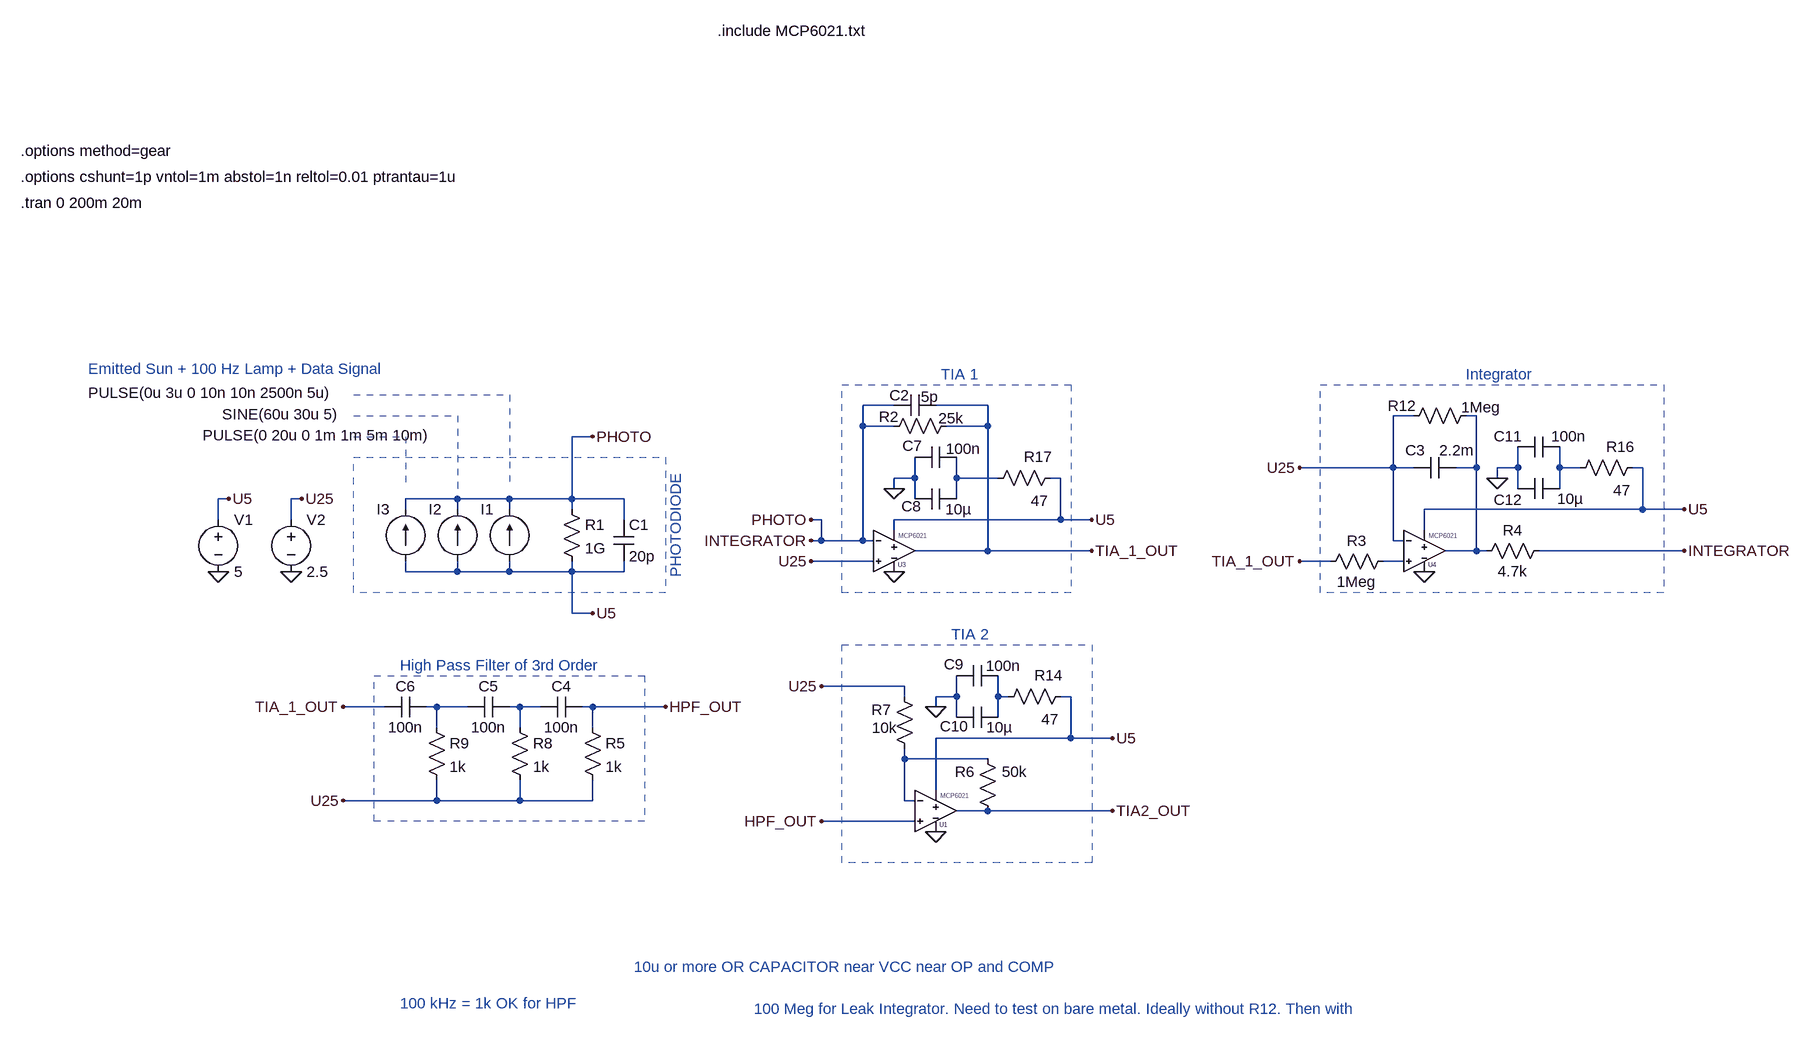
[diagram p0: schematic Odbiornik_WO_TLV3501_REAL_LAMPS.asc]
Odbiornik_WO_TLV3501_REAL_LAMPS.asc, the LTspice schematic file:
Version 4.1
SHEET 1 2432 1780
WIRE 704 336 656 336
WIRE 848 336 768 336
WIRE 1504 352 1472 352
WIRE 1600 352 1584 352
WIRE 656 368 656 336
WIRE 704 368 656 368
WIRE 848 368 848 336
WIRE 848 368 784 368
WIRE 240 384 208 384
WIRE 1472 432 1472 352
WIRE 1472 432 1328 432
WIRE 1504 432 1472 432
WIRE 1600 432 1600 352
WIRE 1600 432 1568 432
WIRE 1664 432 1664 400
WIRE 1664 432 1632 432
WIRE 1728 432 1728 400
WIRE 1760 432 1728 432
WIRE 1856 432 1840 432
WIRE 736 448 736 416
WIRE 736 448 704 448
WIRE 800 448 800 416
WIRE 864 448 800 448
WIRE 960 448 944 448
WIRE 1632 448 1632 432
WIRE 704 464 704 448
WIRE 1664 464 1664 432
WIRE 1728 464 1728 432
WIRE -320 480 -336 480
WIRE -208 480 -224 480
WIRE 32 480 -48 480
WIRE 112 480 32 480
WIRE 208 480 208 384
WIRE 208 480 112 480
WIRE 288 480 208 480
WIRE 736 480 736 448
WIRE 800 480 800 448
WIRE -48 496 -48 480
WIRE 32 496 32 480
WIRE 112 496 112 480
WIRE 208 496 208 480
WIRE 1856 496 1856 432
WIRE 1856 496 1520 496
WIRE 1920 496 1856 496
WIRE -336 512 -336 480
WIRE -224 512 -224 480
WIRE 288 512 288 480
WIRE 592 512 576 512
WIRE 960 512 960 448
WIRE 960 512 704 512
WIRE 1008 512 960 512
WIRE 704 528 704 512
WIRE 1520 528 1520 496
WIRE 592 544 592 512
WIRE 592 544 576 544
WIRE 656 544 656 368
WIRE 656 544 592 544
WIRE 672 544 656 544
WIRE 1472 544 1472 432
WIRE 1488 544 1472 544
WIRE 848 560 848 368
WIRE 848 560 736 560
WIRE 1008 560 848 560
WIRE 1600 560 1600 432
WIRE 1600 560 1552 560
WIRE 1616 560 1600 560
WIRE 1920 560 1696 560
WIRE 672 576 576 576
WIRE 1376 576 1328 576
WIRE 1488 576 1456 576
WIRE -48 592 -48 576
WIRE 32 592 32 576
WIRE 32 592 -48 592
WIRE 112 592 112 576
WIRE 112 592 32 592
WIRE 208 592 208 576
WIRE 208 592 112 592
WIRE 288 592 288 576
WIRE 288 592 208 592
WIRE 208 656 208 592
WIRE 240 656 208 656
WIRE 720 768 592 768
WIRE 720 784 720 768
WIRE 800 784 800 752
WIRE 800 784 768 784
WIRE 864 784 864 752
WIRE 880 784 864 784
WIRE 976 784 960 784
WIRE -80 800 -144 800
WIRE 0 800 -16 800
WIRE 48 800 0 800
WIRE 128 800 112 800
WIRE 160 800 128 800
WIRE 240 800 224 800
WIRE 352 800 240 800
WIRE 768 800 768 784
WIRE 800 816 800 784
WIRE 864 816 864 784
WIRE 0 832 0 800
WIRE 128 832 128 800
WIRE 240 832 240 800
WIRE 976 848 976 784
WIRE 976 848 768 848
WIRE 1040 848 976 848
WIRE 720 880 720 864
WIRE 848 880 720 880
WIRE 768 928 768 848
WIRE 0 944 0 912
WIRE 0 944 -144 944
WIRE 128 944 128 912
WIRE 128 944 0 944
WIRE 240 944 240 912
WIRE 240 944 128 944
WIRE 720 944 720 880
WIRE 736 944 720 944
WIRE 848 960 800 960
WIRE 1040 960 848 960
WIRE 736 976 592 976
FLAG -336 592 0
FLAG -224 592 0
FLAG 1008 560 TIA_1_OUT
FLAG 1040 960 TIA2_OUT
FLAG 240 384 PHOTO
FLAG 240 656 U5
FLAG 1920 496 U5
FLAG 704 592 0
FLAG 1008 512 U5
FLAG 1328 432 U25
FLAG 576 576 U25
FLAG 576 544 INTEGRATOR
FLAG 1920 560 INTEGRATOR
FLAG 1520 592 0
FLAG 1328 576 TIA_1_OUT
FLAG -144 944 U25
FLAG -144 800 TIA_1_OUT
FLAG 352 800 HPF_OUT
FLAG 592 976 HPF_OUT
FLAG 592 768 U25
FLAG 1040 848 U5
FLAG 768 992 0
FLAG -320 480 U5
FLAG -208 480 U25
FLAG 576 512 PHOTO
FLAG 1632 448 0
FLAG 704 464 0
FLAG 768 800 0
SYMBOL res 192 480 R0
SYMATTR InstName R1
SYMATTR Value 1G
SYMBOL cap 272 512 R0
SYMATTR InstName C1
SYMATTR Value 20p
SYMBOL current 112 576 R180
WINDOW 0 24 80 Left 2
WINDOW 3 648 259 Right 2
WINDOW 123 0 0 Left 0
WINDOW 39 0 0 Left 0
SYMATTR InstName I1
SYMATTR Value PULSE(0u 3u 0 10n 10n 2500n 5u)
SYMBOL voltage -336 496 R0
WINDOW 123 0 0 Left 0
WINDOW 39 0 0 Left 0
SYMATTR InstName V1
SYMATTR Value 5
SYMBOL voltage -224 496 R0
WINDOW 123 0 0 Left 0
WINDOW 39 0 0 Left 0
SYMATTR InstName V2
SYMATTR Value 2.5
SYMBOL res 800 352 R90
WINDOW 0 17 104 VBottom 2
WINDOW 3 -12 8 VTop 2
SYMATTR InstName R2
SYMATTR Value 25k
SYMBOL cap 768 320 R90
WINDOW 0 16 56 VBottom 2
WINDOW 3 -13 9 VTop 2
SYMATTR InstName C2
SYMATTR Value 5p
SYMBOL res 1360 592 R270
WINDOW 0 32 56 VTop 2
WINDOW 3 0 56 VBottom 2
SYMATTR InstName R3
SYMATTR Value 1Meg
SYMBOL cap 1504 448 R270
WINDOW 0 27 2 VTop 2
WINDOW 3 27 66 VTop 2
SYMATTR InstName C3
SYMATTR Value 2.2m
SYMBOL res 1600 576 R270
WINDOW 0 32 56 VTop 2
WINDOW 3 0 56 VBottom 2
SYMATTR InstName R4
SYMATTR Value 4.7k
SYMBOL current 32 576 R180
WINDOW 0 24 80 Left 2
WINDOW 3 362 226 Right 2
WINDOW 123 0 0 Left 0
WINDOW 39 0 0 Left 0
SYMATTR InstName I2
SYMATTR Value SINE(60u 30u 5)
SYMBOL cap 224 784 R90
WINDOW 0 0 32 VBottom 2
WINDOW 3 32 32 VTop 2
SYMATTR InstName C4
SYMATTR Value 100n
SYMBOL res 224 816 R0
SYMATTR InstName R5
SYMATTR Value 1k
SYMBOL res 864 976 R180
WINDOW 0 36 76 Left 2
WINDOW 3 -45 76 Left 2
SYMATTR InstName R6
SYMATTR Value 50k
SYMBOL res 736 880 R180
WINDOW 0 36 76 Left 2
WINDOW 3 27 48 Left 2
SYMATTR InstName R7
SYMATTR Value 10k
SYMBOL MCP6021 768 960 R0
SYMATTR InstName U1
SYMBOL MCP6021 704 560 R0
SYMATTR InstName U3
SYMBOL MCP6021 1520 560 R0
SYMATTR InstName U4
SYMBOL cap 112 784 R90
WINDOW 0 0 32 VBottom 2
WINDOW 3 32 32 VTop 2
SYMATTR InstName C5
SYMATTR Value 100n
SYMBOL res 112 816 R0
SYMATTR InstName R8
SYMATTR Value 1k
SYMBOL current -48 576 R180
WINDOW 0 24 80 Left 2
WINDOW 3 312 194 Right 2
WINDOW 123 0 0 Left 0
WINDOW 39 0 0 Left 0
SYMATTR InstName I3
SYMATTR Value PULSE(0 20u 0 1m 1m 5m 10m)
SYMBOL cap -16 784 R90
WINDOW 0 0 32 VBottom 2
WINDOW 3 32 32 VTop 2
SYMATTR InstName C6
SYMATTR Value 100n
SYMBOL res -16 816 R0
SYMATTR InstName R9
SYMATTR Value 1k
SYMBOL res 1488 368 R270
WINDOW 0 16 -2 VTop 2
WINDOW 3 45 119 VBottom 2
SYMATTR InstName R12
SYMATTR Value 1Meg
SYMBOL cap 864 736 R90
WINDOW 0 14 68 VBottom 2
WINDOW 3 -15 -8 VTop 2
SYMATTR InstName C9
SYMATTR Value 100n
SYMBOL cap 864 800 R90
WINDOW 0 45 67 VBottom 2
WINDOW 3 16 -2 VTop 2
SYMATTR InstName C10
SYMATTR Value 10µ
SYMBOL cap 800 400 R90
WINDOW 0 14 68 VBottom 2
WINDOW 3 -13 -11 VTop 2
SYMATTR InstName C7
SYMATTR Value 100n
SYMBOL cap 800 464 R90
WINDOW 0 43 69 VBottom 2
WINDOW 3 16 -3 VTop 2
SYMATTR InstName C8
SYMATTR Value 10µ
SYMBOL cap 1728 384 R90
WINDOW 0 15 79 VBottom 2
WINDOW 3 15 -14 VBottom 2
SYMATTR InstName C11
SYMATTR Value 100n
SYMBOL cap 1728 448 R90
WINDOW 0 18 79 VTop 2
WINDOW 3 16 -17 VTop 2
SYMATTR InstName C12
SYMATTR Value 10µ
SYMBOL res 976 768 R90
WINDOW 0 -1 34 VBottom 2
WINDOW 3 35 32 VTop 2
SYMATTR InstName R14
SYMATTR Value 47
SYMBOL res 1856 416 R90
WINDOW 0 -1 34 VBottom 2
WINDOW 3 35 32 VTop 2
SYMATTR InstName R16
SYMATTR Value 47
SYMBOL res 960 432 R90
WINDOW 0 -1 34 VBottom 2
WINDOW 3 35 32 VTop 2
SYMATTR InstName R17
SYMATTR Value 47
TEXT -640 24 Left 2 !.tran 0 200m 20m
TEXT 432 -240 Left 2 !.include MCP6021.txt
TEXT -640 -56 Left 2 !.options method=gear
TEXT -640 -16 Left 2 !.options cshunt=1p vntol=1m abstol=1n reltol=0.01 ptrantau=1u
TEXT -56 1256 Left 2 ;100 kHz = 1k OK for HPF
TEXT 368 440 VRight 2 ;PHOTODIODE
TEXT -536 280 Left 2 ;Emitted Sun + 100 Hz Lamp + Data Signal
TEXT 776 288 Left 2 ;TIA 1
TEXT 1584 288 Left 2 ;Integrator
TEXT -56 736 Left 2 ;High Pass Filter of 3rd Order
TEXT 792 688 Left 2 ;TIA 2
TEXT 488 1264 Left 2 ;100 Meg for Leak Integrator. Need to test on bare metal. Ideally without R12. Then with
TEXT 304 1200 Left 2 ;10u or more OR CAPACITOR near VCC near OP and COMP
LINE Normal 112 320 112 464 2
LINE Normal -128 320 112 320 2
LINE Normal 32 352 32 464 2
LINE Normal -128 352 32 352 2
LINE Normal -48 384 -48 464 2
LINE Normal -128 384 -48 384 2
RECTANGLE Normal -128 416 352 624 1
RECTANGLE Normal 976 624 624 304 1
RECTANGLE Normal 1360 304 1888 624 1
RECTANGLE Normal 320 976 -96 752 1
RECTANGLE Normal 1008 1040 624 704 1

The netlist it stands for:
* Odbiornik_WO_TLV3501_REAL_LAMPS.asc
R1 INTEGRATOR U5 1G
C1 INTEGRATOR U5 20p
I1 U5 INTEGRATOR PULSE(0u 3u 0 10n 10n 2500n 5u)
V1 U5 0 5
V2 U25 0 2.5
R2 TIA_1_OUT INTEGRATOR 25k
C2 TIA_1_OUT INTEGRATOR 5p
R3 TIA_1_OUT N004 1Meg
C3 U25 N001 2.2m
R4 N001 INTEGRATOR 4.7k
I2 U5 INTEGRATOR SINE(60u 30u 5)
C4 HPF_OUT N007 100n
R5 HPF_OUT U25 1k
R6 TIA2_OUT N008 50k
R7 N008 U25 10k
X§U1 HPF_OUT N008 U5 0 TIA2_OUT MCP6021  ; pins In+ In- V+ V- OUT
X§U3 U25 INTEGRATOR U5 0 TIA_1_OUT MCP6021  ; pins In+ In- V+ V- OUT
X§U4 N004 U25 U5 0 N001 MCP6021  ; pins In+ In- V+ V- OUT
C5 N007 N006 100n
R8 N007 U25 1k
I3 U5 INTEGRATOR PULSE(0 20u 0 1m 1m 5m 10m)
C6 N006 TIA_1_OUT 100n
R9 N006 U25 1k
R12 U25 N001 1Meg
C9 N005 0 100n
C10 N005 0 10µ
C7 N003 0 100n
C8 N003 0 10µ
C11 N002 0 100n
C12 N002 0 10µ
R14 U5 N005 47
R16 U5 N002 47
R17 U5 N003 47
.tran 0 200m 20m
.include MCP6021.txt
.options method=gear
.options cshunt=1p vntol=1m abstol=1n reltol=0.01 ptrantau=1u
* 100 kHz = 1k OK for HPF
* PHOTODIODE
* Emitted Sun + 100 Hz Lamp + Data Signal
* TIA 1
* Integrator
* High Pass Filter of 3rd Order
* TIA 2
* 100 Meg for Leak Integrator. Need to test on bare metal. Ideally without R12. Then with
* 10u or more OR CAPACITOR near VCC near OP and COMP
.backanno
.end